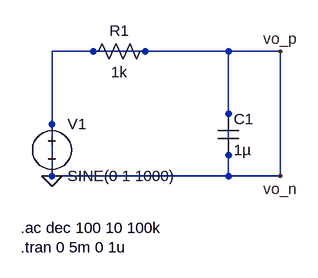
[diagram p0: schematic 08_circuit_generated-by-claude-sonnet-4-6.asc]
08_circuit_generated-by-claude-sonnet-4-6.asc, the LTspice schematic file:
Version 4
SHEET 1 880 680
WIRE 128 128 272 128
WIRE 272 128 400 128
WIRE 400 128 400 320
WIRE 400 320 128 320
WIRE 128 320 128 128
WIRE 400 128 480 128
WIRE 480 128 480 224
WIRE 480 224 480 320
WIRE 480 320 400 320
FLAG 128 320 0
FLAG 480 128 vo_p
FLAG 480 320 vo_n
SYMBOL voltage 128 224 R0
SYMATTR InstName V1
SYMATTR Value SINE(0 1 1000)
SYMATTR SpiceLine AC 1
SYMBOL res 288 112 R90
WINDOW 0 0 56 VBottom 2
WINDOW 3 32 56 VTop 2
SYMATTR InstName R1
SYMATTR Value 1k
SYMBOL cap 384 224 R0
SYMATTR InstName C1
SYMATTR Value 1µ
SYMATTR IC 0
TEXT 80 400 Left 2 !.ac dec 100 10 100k
TEXT 80 430 Left 2 !.tran 0 5m 0 1u

The netlist it stands for:
* 08_circuit_generated-by-claude-sonnet-4-6.asc
V1 0 0 SINE(0 1 1000) AC 1
R1 0 0 1k
C1 0 0 1µ
.ac dec 100 10 100k
.tran 0 5m 0 1u
.backanno
.end